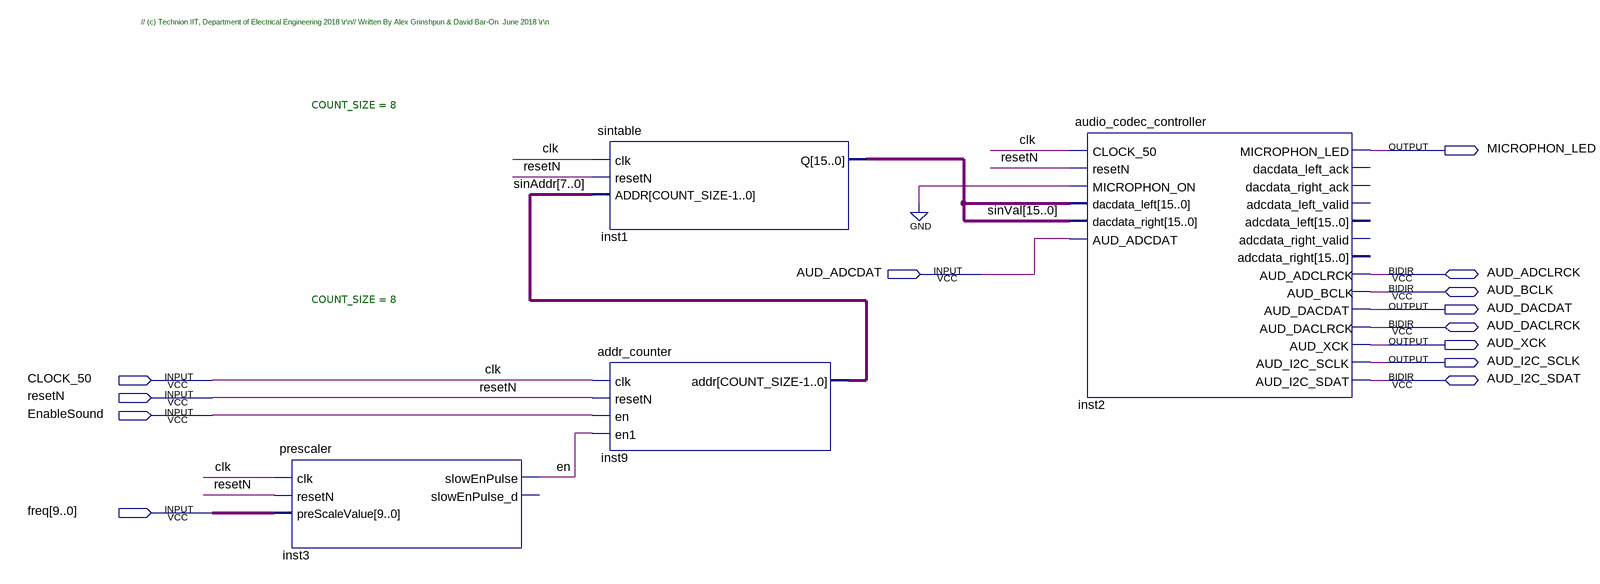
[diagram p0: schematic sheet]
// Quartus schematic TOP_MSS.bdf as structural Verilog: 4 symbols, 13 pins
module TOP_MSS (
  input  AUD_ADCDAT,
  input  CLOCK_50,
  input  resetN,
  input  EnableSound,
  input  [9:0] freq,
  inout  AUD_ADCLRCK,
  inout  AUD_BCLK,
  inout  AUD_DACLRCK,
  inout  AUD_I2C_SDAT,
  output MICROPHON_LED,
  output AUD_DACDAT,
  output AUD_XCK,
  output AUD_I2C_SCLK
);

  wire en;
  wire [7:0] sinAddr;
  wire [15:0] sinVal;

  prescaler inst3 (.clk(CLOCK_50), .resetN(resetN), .preScaleValue(freq), .slowEnPulse(en));  // open: slowEnPulse_d
  sintable #(.COUNT_SIZE(8)) inst1 (.clk(CLOCK_50), .resetN(resetN), .ADDR(sinAddr), .Q(sinVal));
  addr_counter #(.COUNT_SIZE(8)) inst9 (.clk(CLOCK_50), .resetN(resetN), .en(EnableSound), .en1(en), .addr(sinAddr));
  audio_codec_controller inst2 (
    .CLOCK_50(CLOCK_50), .resetN(resetN), .MICROPHON_ON(1'b0), .dacdata_left(sinVal), .dacdata_right(sinVal),
    .AUD_ADCDAT(AUD_ADCDAT), .MICROPHON_LED(MICROPHON_LED), .AUD_DACDAT(AUD_DACDAT), .AUD_XCK(AUD_XCK),
    .AUD_I2C_SCLK(AUD_I2C_SCLK), .AUD_ADCLRCK(AUD_ADCLRCK), .AUD_BCLK(AUD_BCLK), .AUD_DACLRCK(AUD_DACLRCK),
    .AUD_I2C_SDAT(AUD_I2C_SDAT));  // open: dacdata_left_ack, dacdata_right_ack, adcdata_left_valid, adcdata_left, adcdata_right_valid, adcdata_right

  // Other names for the same wires on the sheet: clk = CLOCK_50

  // Notes on the sheet:
  //   // (c) Technion IIT, Department of Electrical Engineering 2018 \r\n// Written By Alex Grinshpun & David Bar-On  June 2018 \r\n
endmodule
